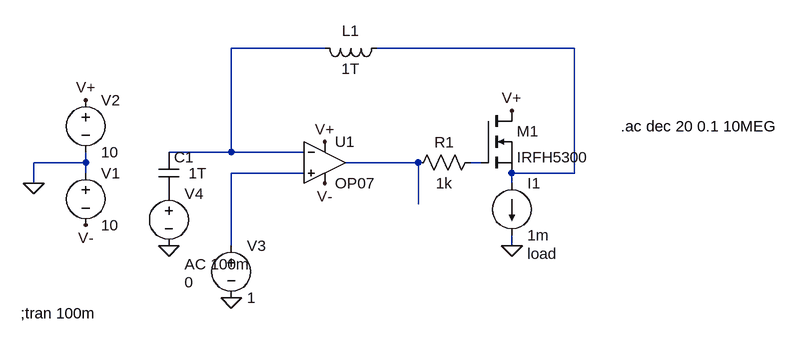
[diagram p0: schematic lag_comp.asc]
lag_comp.asc, the LTspice schematic file:
Version 4
SHEET 1 1088 680
WIRE 352 0 208 0
WIRE 736 0 432 0
WIRE 208 160 208 0
WIRE 208 160 112 160
WIRE 320 160 208 160
WIRE -16 176 -16 160
WIRE -16 176 -96 176
WIRE 496 176 384 176
WIRE 592 176 576 176
WIRE -16 192 -16 176
WIRE 320 192 208 192
WIRE 736 192 736 0
WIRE 736 192 640 192
WIRE -96 208 -96 176
WIRE 640 208 640 192
WIRE 496 240 496 176
WIRE 208 304 208 192
WIRE 640 304 640 288
FLAG -96 208 0
FLAG -16 80 V+
FLAG 352 144 V+
FLAG 352 208 V-
FLAG -16 272 V-
FLAG 208 384 0
FLAG 112 304 0
FLAG 640 304 0
FLAG 640 96 V+
SYMBOL OpAmps\\OP07 352 112 R0
SYMATTR InstName U1
SYMBOL voltage -16 176 R0
WINDOW 123 0 0 Left 0
WINDOW 39 0 0 Left 0
SYMATTR InstName V1
SYMATTR Value 10
SYMBOL voltage -16 64 R0
WINDOW 123 0 0 Left 0
WINDOW 39 0 0 Left 0
SYMATTR InstName V2
SYMATTR Value 10
SYMBOL voltage 208 288 R0
WINDOW 123 0 0 Left 0
WINDOW 39 0 0 Left 0
SYMATTR InstName V3
SYMATTR Value 1
SYMBOL ind 448 -16 R90
WINDOW 0 5 56 VBottom 2
WINDOW 3 32 56 VTop 2
SYMATTR InstName L1
SYMATTR Value 1T
SYMBOL cap 96 160 R0
WINDOW 3 46 32 Left 2
SYMATTR InstName C1
SYMATTR Value 1T
SYMBOL voltage 112 208 R0
WINDOW 3 24 152 Left 2
WINDOW 123 24 124 Left 2
WINDOW 39 0 0 Left 0
SYMATTR InstName V4
SYMATTR Value 0
SYMATTR Value2 AC 100m
SYMBOL nmos 592 96 R0
SYMATTR InstName M1
SYMATTR Value IRFH5300
SYMBOL current 640 208 R0
WINDOW 123 0 0 Left 0
WINDOW 39 24 108 Left 2
SYMATTR InstName I1
SYMATTR Value 1m
SYMATTR SpiceLine load
SYMBOL res 592 160 R90
WINDOW 0 0 56 VBottom 2
WINDOW 3 32 56 VTop 2
SYMATTR InstName R1
SYMATTR Value 1k
TEXT -116 408 Left 2 !;tran 100m
TEXT 808 120 Left 2 !.ac dec 20 0.1 10MEG

The netlist it stands for:
* lag_comp.asc
XU1 N005 N001 V+ V- N003 LT1001  ; OP07, pins In+ In- V+ V- OUT
V1 0 V- 10
V2 V+ 0 10
V3 N005 0 1
L1 N002 N001 1T
C1 N001 P001 1T
V4 P001 0 0 AC 100m
M1 V+ N004 N002 N002 IRFH5300
I1 N002 0 1m load
R1 N004 N003 1k
.model NMOS NMOS
.model PMOS PMOS
.lib standard.mos
;tran 100m
.ac dec 20 0.1 10MEG
.lib LTC.lib
.backanno
.end